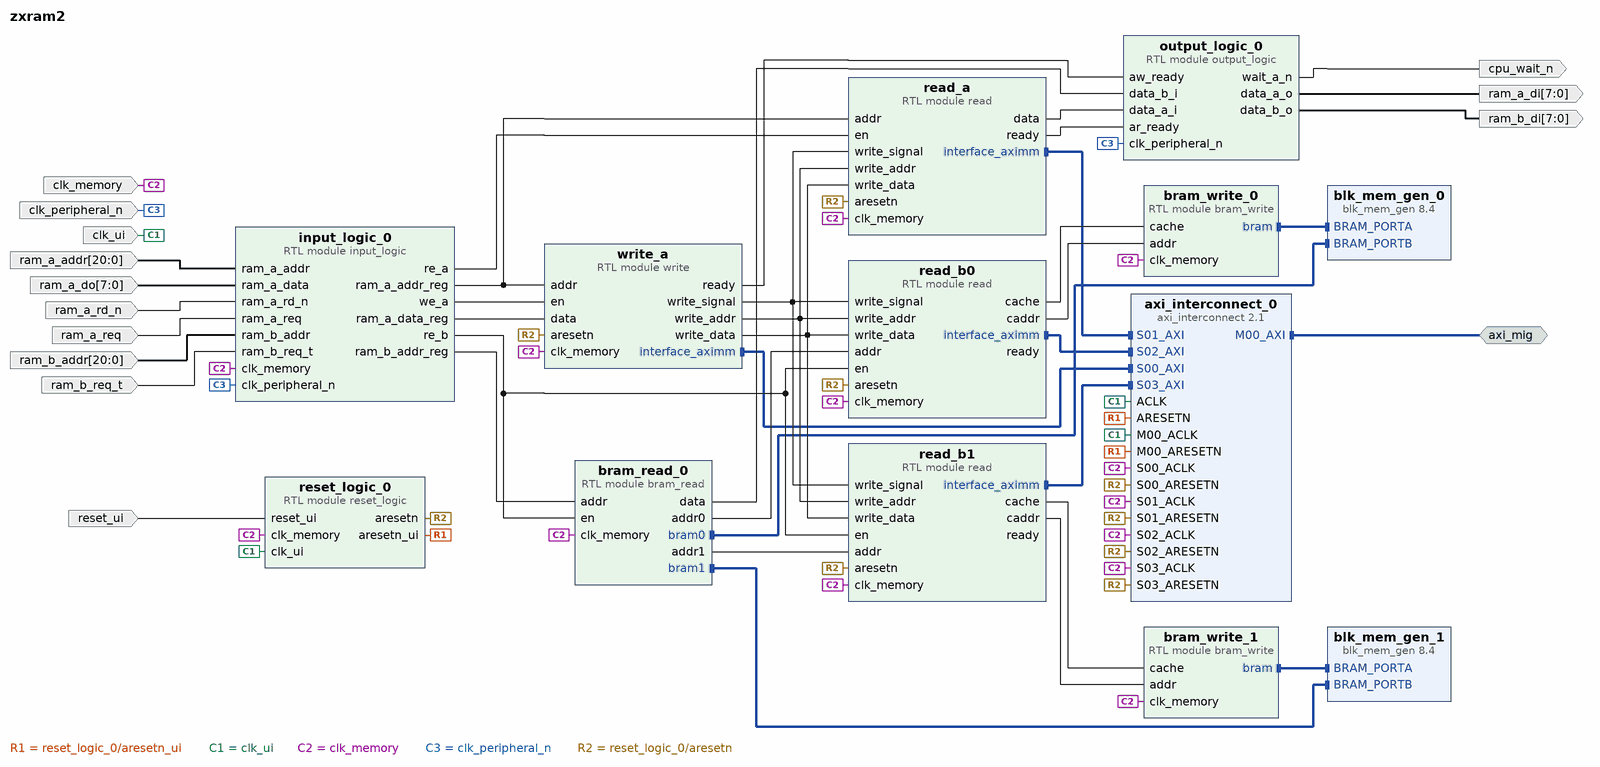
[diagram p0: block diagram of the top level]
# Vivado block design zxram2, xc7a100tcsg324-1, Vivado 2021.2
create_bd_design zxram2

create_bd_intf_port -mode Master -vlnv xilinx.com:interface:aximm_rtl:1.0 axi_mig
set_property -dict [list \
  CONFIG.ADDR_WIDTH 27 \
  CONFIG.DATA_WIDTH 64 \
  CONFIG.FREQ_HZ 150015000 \
  CONFIG.NUM_READ_OUTSTANDING 2 \
  CONFIG.NUM_WRITE_OUTSTANDING 2 \
  CONFIG.PROTOCOL AXI4 \
] [get_bd_intf_ports axi_mig]
create_bd_port -dir I ram_a_req
create_bd_port -dir I ram_a_rd_n
create_bd_port -dir I ram_b_req_t
create_bd_port -dir O cpu_wait_n
create_bd_port -dir I -from 20 -to 0 ram_a_addr
create_bd_port -dir I -from 20 -to 0 ram_b_addr
create_bd_port -dir I -type clk clk_ui
set_property -dict [list \
  CONFIG.ASSOCIATED_BUSIF axi_mig \
  CONFIG.ASSOCIATED_RESET reset_ui \
  CONFIG.FREQ_HZ 150015000 \
] [get_bd_ports clk_ui]
create_bd_port -dir I -type rst reset_ui
set_property -dict {CONFIG.POLARITY ACTIVE_HIGH} [get_bd_ports reset_ui]
create_bd_port -dir I -from 7 -to 0 ram_a_do
create_bd_port -dir O -from 7 -to 0 ram_a_di
create_bd_port -dir O -from 7 -to 0 ram_b_di
create_bd_port -dir I -type clk clk_memory
set_property -dict {CONFIG.FREQ_HZ 140000000} [get_bd_ports clk_memory]
create_bd_port -dir I -type clk clk_peripheral_n
set_property -dict {CONFIG.FREQ_HZ 28000000} [get_bd_ports clk_peripheral_n]

create_bd_cell -type module -reference reset_logic reset_logic_0
create_bd_cell -type ip -vlnv xilinx.com:ip:axi_interconnect:2.1 axi_interconnect_0
set_property -dict [list \
  CONFIG.ENABLE_ADVANCED_OPTIONS 0 \
  CONFIG.NUM_MI 1 \
  CONFIG.NUM_SI 4 \
  CONFIG.S00_HAS_DATA_FIFO 2 \
  CONFIG.S01_HAS_DATA_FIFO 2 \
  CONFIG.S02_HAS_DATA_FIFO 2 \
  CONFIG.S03_HAS_DATA_FIFO 2 \
  CONFIG.S04_HAS_DATA_FIFO 2 \
  CONFIG.S05_HAS_DATA_FIFO 2 \
  CONFIG.S06_HAS_DATA_FIFO 2 \
  CONFIG.S07_HAS_DATA_FIFO 2 \
  CONFIG.S08_HAS_DATA_FIFO 2 \
  CONFIG.S09_HAS_DATA_FIFO 2 \
  CONFIG.S10_HAS_DATA_FIFO 2 \
  CONFIG.S11_HAS_DATA_FIFO 2 \
  CONFIG.S12_HAS_DATA_FIFO 2 \
  CONFIG.S13_HAS_DATA_FIFO 2 \
  CONFIG.STRATEGY 2 \
] [get_bd_cells axi_interconnect_0]
create_bd_cell -type module -reference output_logic output_logic_0
create_bd_cell -type module -reference input_logic input_logic_0
create_bd_cell -type module -reference write write_a
create_bd_cell -type module -reference read read_a
create_bd_cell -type module -reference read read_b1
create_bd_cell -type module -reference read read_b0
create_bd_cell -type ip -vlnv xilinx.com:ip:blk_mem_gen:8.4 blk_mem_gen_0
set_property -dict [list \
  CONFIG.Enable_32bit_Address false \
  CONFIG.Enable_B Use_ENB_Pin \
  CONFIG.Memory_Type True_Dual_Port_RAM \
  CONFIG.Port_B_Clock 100 \
  CONFIG.Port_B_Enable_Rate 100 \
  CONFIG.Port_B_Write_Rate 50 \
  CONFIG.Read_Width_A 64 \
  CONFIG.Read_Width_B 8 \
  CONFIG.Register_PortA_Output_of_Memory_Primitives true \
  CONFIG.Register_PortB_Output_of_Memory_Primitives true \
  CONFIG.Use_Byte_Write_Enable false \
  CONFIG.Use_RSTA_Pin false \
  CONFIG.Use_RSTB_Pin false \
  CONFIG.Write_Depth_A 8192 \
  CONFIG.Write_Width_A 64 \
  CONFIG.Write_Width_B 8 \
  CONFIG.use_bram_block Stand_Alone \
] [get_bd_cells blk_mem_gen_0]
create_bd_cell -type ip -vlnv xilinx.com:ip:blk_mem_gen:8.4 blk_mem_gen_1
set_property -dict [list \
  CONFIG.Enable_32bit_Address false \
  CONFIG.Enable_B Use_ENB_Pin \
  CONFIG.Memory_Type True_Dual_Port_RAM \
  CONFIG.Port_B_Clock 100 \
  CONFIG.Port_B_Enable_Rate 100 \
  CONFIG.Port_B_Write_Rate 50 \
  CONFIG.Read_Width_A 64 \
  CONFIG.Read_Width_B 8 \
  CONFIG.Register_PortA_Output_of_Memory_Primitives true \
  CONFIG.Register_PortB_Output_of_Memory_Primitives true \
  CONFIG.Use_Byte_Write_Enable false \
  CONFIG.Use_RSTA_Pin false \
  CONFIG.Use_RSTB_Pin false \
  CONFIG.Write_Depth_A 8192 \
  CONFIG.Write_Width_A 64 \
  CONFIG.Write_Width_B 8 \
  CONFIG.use_bram_block Stand_Alone \
] [get_bd_cells blk_mem_gen_1]
create_bd_cell -type module -reference bram_read bram_read_0
create_bd_cell -type module -reference bram_write bram_write_0
create_bd_cell -type module -reference bram_write bram_write_1

# ---- connections ----

connect_bd_intf_net [get_bd_intf_ports axi_mig] [get_bd_intf_pins axi_interconnect_0/M00_AXI]
connect_bd_intf_net [get_bd_intf_pins bram_read_0/bram0] [get_bd_intf_pins blk_mem_gen_0/BRAM_PORTB]
connect_bd_intf_net [get_bd_intf_pins bram_read_0/bram1] [get_bd_intf_pins blk_mem_gen_1/BRAM_PORTB]
connect_bd_intf_net [get_bd_intf_pins bram_write_0/bram] [get_bd_intf_pins blk_mem_gen_0/BRAM_PORTA]
connect_bd_intf_net [get_bd_intf_pins bram_write_1/bram] [get_bd_intf_pins blk_mem_gen_1/BRAM_PORTA]
connect_bd_intf_net -intf_net read_a0_interface_aximm [get_bd_intf_pins read_a/interface_aximm] [get_bd_intf_pins axi_interconnect_0/S01_AXI]
connect_bd_intf_net -intf_net read_b0_0_interface_aximm [get_bd_intf_pins read_b0/interface_aximm] [get_bd_intf_pins axi_interconnect_0/S02_AXI]
connect_bd_intf_net -intf_net read_b0_1_interface_aximm [get_bd_intf_pins read_b1/interface_aximm] [get_bd_intf_pins axi_interconnect_0/S03_AXI]
connect_bd_intf_net [get_bd_intf_pins write_a/interface_aximm] [get_bd_intf_pins axi_interconnect_0/S00_AXI]
connect_bd_net -net ARESETN_1 [get_bd_pins reset_logic_0/aresetn_ui] \
  [get_bd_pins axi_interconnect_0/ARESETN] [get_bd_pins axi_interconnect_0/M00_ARESETN]
connect_bd_net -net M00_ACLK_1 [get_bd_ports clk_ui] \
  [get_bd_pins reset_logic_0/clk_ui] [get_bd_pins axi_interconnect_0/ACLK] [get_bd_pins axi_interconnect_0/M00_ACLK]
connect_bd_net [get_bd_pins write_a/write_signal] \
  [get_bd_pins read_a/write_signal] [get_bd_pins read_b1/write_signal] [get_bd_pins read_b0/write_signal]
connect_bd_net -net arbitrator_0_wait_n [get_bd_pins output_logic_0/wait_a_n] [get_bd_ports cpu_wait_n]
connect_bd_net [get_bd_pins bram_read_0/addr0] [get_bd_pins read_b0/addr]
connect_bd_net [get_bd_pins bram_read_0/addr1] [get_bd_pins read_b1/addr]
connect_bd_net [get_bd_pins bram_read_0/data] [get_bd_pins output_logic_0/data_b_i]
connect_bd_net [get_bd_ports clk_memory] \
  [get_bd_pins reset_logic_0/clk_memory] [get_bd_pins axi_interconnect_0/S00_ACLK] [get_bd_pins axi_interconnect_0/S01_ACLK] \
  [get_bd_pins axi_interconnect_0/S02_ACLK] [get_bd_pins axi_interconnect_0/S03_ACLK] [get_bd_pins input_logic_0/clk_memory] \
  [get_bd_pins write_a/clk_memory] [get_bd_pins read_a/clk_memory] [get_bd_pins read_b1/clk_memory] \
  [get_bd_pins read_b0/clk_memory] [get_bd_pins bram_read_0/clk_memory] [get_bd_pins bram_write_0/clk_memory] \
  [get_bd_pins bram_write_1/clk_memory]
connect_bd_net [get_bd_ports clk_peripheral_n] [get_bd_pins output_logic_0/clk_peripheral_n] [get_bd_pins input_logic_0/clk_peripheral_n]
connect_bd_net [get_bd_pins input_logic_0/ram_b_addr_reg] [get_bd_pins bram_read_0/addr]
connect_bd_net [get_bd_pins input_logic_0/re_a] [get_bd_pins read_a/en]
connect_bd_net [get_bd_pins input_logic_0/re_b] [get_bd_pins read_b0/en] [get_bd_pins read_b1/en] [get_bd_pins bram_read_0/en]
connect_bd_net [get_bd_pins input_logic_0/we_a] [get_bd_pins write_a/en]
connect_bd_net -net logic_controller_0_aresetn [get_bd_pins reset_logic_0/aresetn] \
  [get_bd_pins axi_interconnect_0/S00_ARESETN] [get_bd_pins axi_interconnect_0/S01_ARESETN] \
  [get_bd_pins axi_interconnect_0/S02_ARESETN] [get_bd_pins axi_interconnect_0/S03_ARESETN] [get_bd_pins write_a/aresetn] \
  [get_bd_pins read_a/aresetn] [get_bd_pins read_b1/aresetn] [get_bd_pins read_b0/aresetn]
connect_bd_net [get_bd_pins output_logic_0/data_a_o] [get_bd_ports ram_a_di]
connect_bd_net [get_bd_pins output_logic_0/data_b_o] [get_bd_ports ram_b_di]
connect_bd_net [get_bd_ports ram_a_addr] [get_bd_pins input_logic_0/ram_a_addr]
connect_bd_net -net ram_a_addr_2 [get_bd_pins input_logic_0/ram_a_addr_reg] [get_bd_pins write_a/addr] [get_bd_pins read_a/addr]
connect_bd_net -net ram_a_do_1 [get_bd_pins input_logic_0/ram_a_data_reg] [get_bd_pins write_a/data]
connect_bd_net [get_bd_ports ram_a_do] [get_bd_pins input_logic_0/ram_a_data]
connect_bd_net [get_bd_ports ram_a_rd_n] [get_bd_pins input_logic_0/ram_a_rd_n]
connect_bd_net [get_bd_ports ram_a_req] [get_bd_pins input_logic_0/ram_a_req]
connect_bd_net [get_bd_ports ram_b_addr] [get_bd_pins input_logic_0/ram_b_addr]
connect_bd_net [get_bd_ports ram_b_req_t] [get_bd_pins input_logic_0/ram_b_req_t]
connect_bd_net [get_bd_pins read_a/data] [get_bd_pins output_logic_0/data_a_i]
connect_bd_net [get_bd_pins read_a/ready] [get_bd_pins output_logic_0/ar_ready]
connect_bd_net [get_bd_pins read_b0/cache] [get_bd_pins bram_write_0/cache]
connect_bd_net [get_bd_pins read_b0/caddr] [get_bd_pins bram_write_0/addr]
# net read_b0_ready has one end: read_b0/ready
connect_bd_net [get_bd_pins read_b1/cache] [get_bd_pins bram_write_1/cache]
connect_bd_net [get_bd_pins read_b1/caddr] [get_bd_pins bram_write_1/addr]
# net read_b1_ready has one end: read_b1/ready
connect_bd_net [get_bd_ports reset_ui] [get_bd_pins reset_logic_0/reset_ui]
connect_bd_net [get_bd_pins write_a/ready] [get_bd_pins output_logic_0/aw_ready]
connect_bd_net [get_bd_pins write_a/write_addr] [get_bd_pins read_a/write_addr] [get_bd_pins read_b1/write_addr] [get_bd_pins read_b0/write_addr]
connect_bd_net [get_bd_pins write_a/write_data] [get_bd_pins read_a/write_data] [get_bd_pins read_b1/write_data] [get_bd_pins read_b0/write_data]

# ---- address map ----
assign_bd_address -offset 0x0000000 -range 2M -target_address_space [get_bd_addr_spaces read_a/interface_aximm] [get_bd_addr_segs axi_mig/Reg]
assign_bd_address -offset 0x0000000 -range 2M -target_address_space [get_bd_addr_spaces read_b0/interface_aximm] [get_bd_addr_segs axi_mig/Reg]
assign_bd_address -offset 0x0000000 -range 2M -target_address_space [get_bd_addr_spaces read_b1/interface_aximm] [get_bd_addr_segs axi_mig/Reg]
assign_bd_address -offset 0x0000000 -range 2M -target_address_space [get_bd_addr_spaces write_a/interface_aximm] [get_bd_addr_segs axi_mig/Reg]

validate_bd_design
save_bd_design
